# EAGLE design LiPo-Rechargable-ESP2866 (EAGLE 7.5.0)
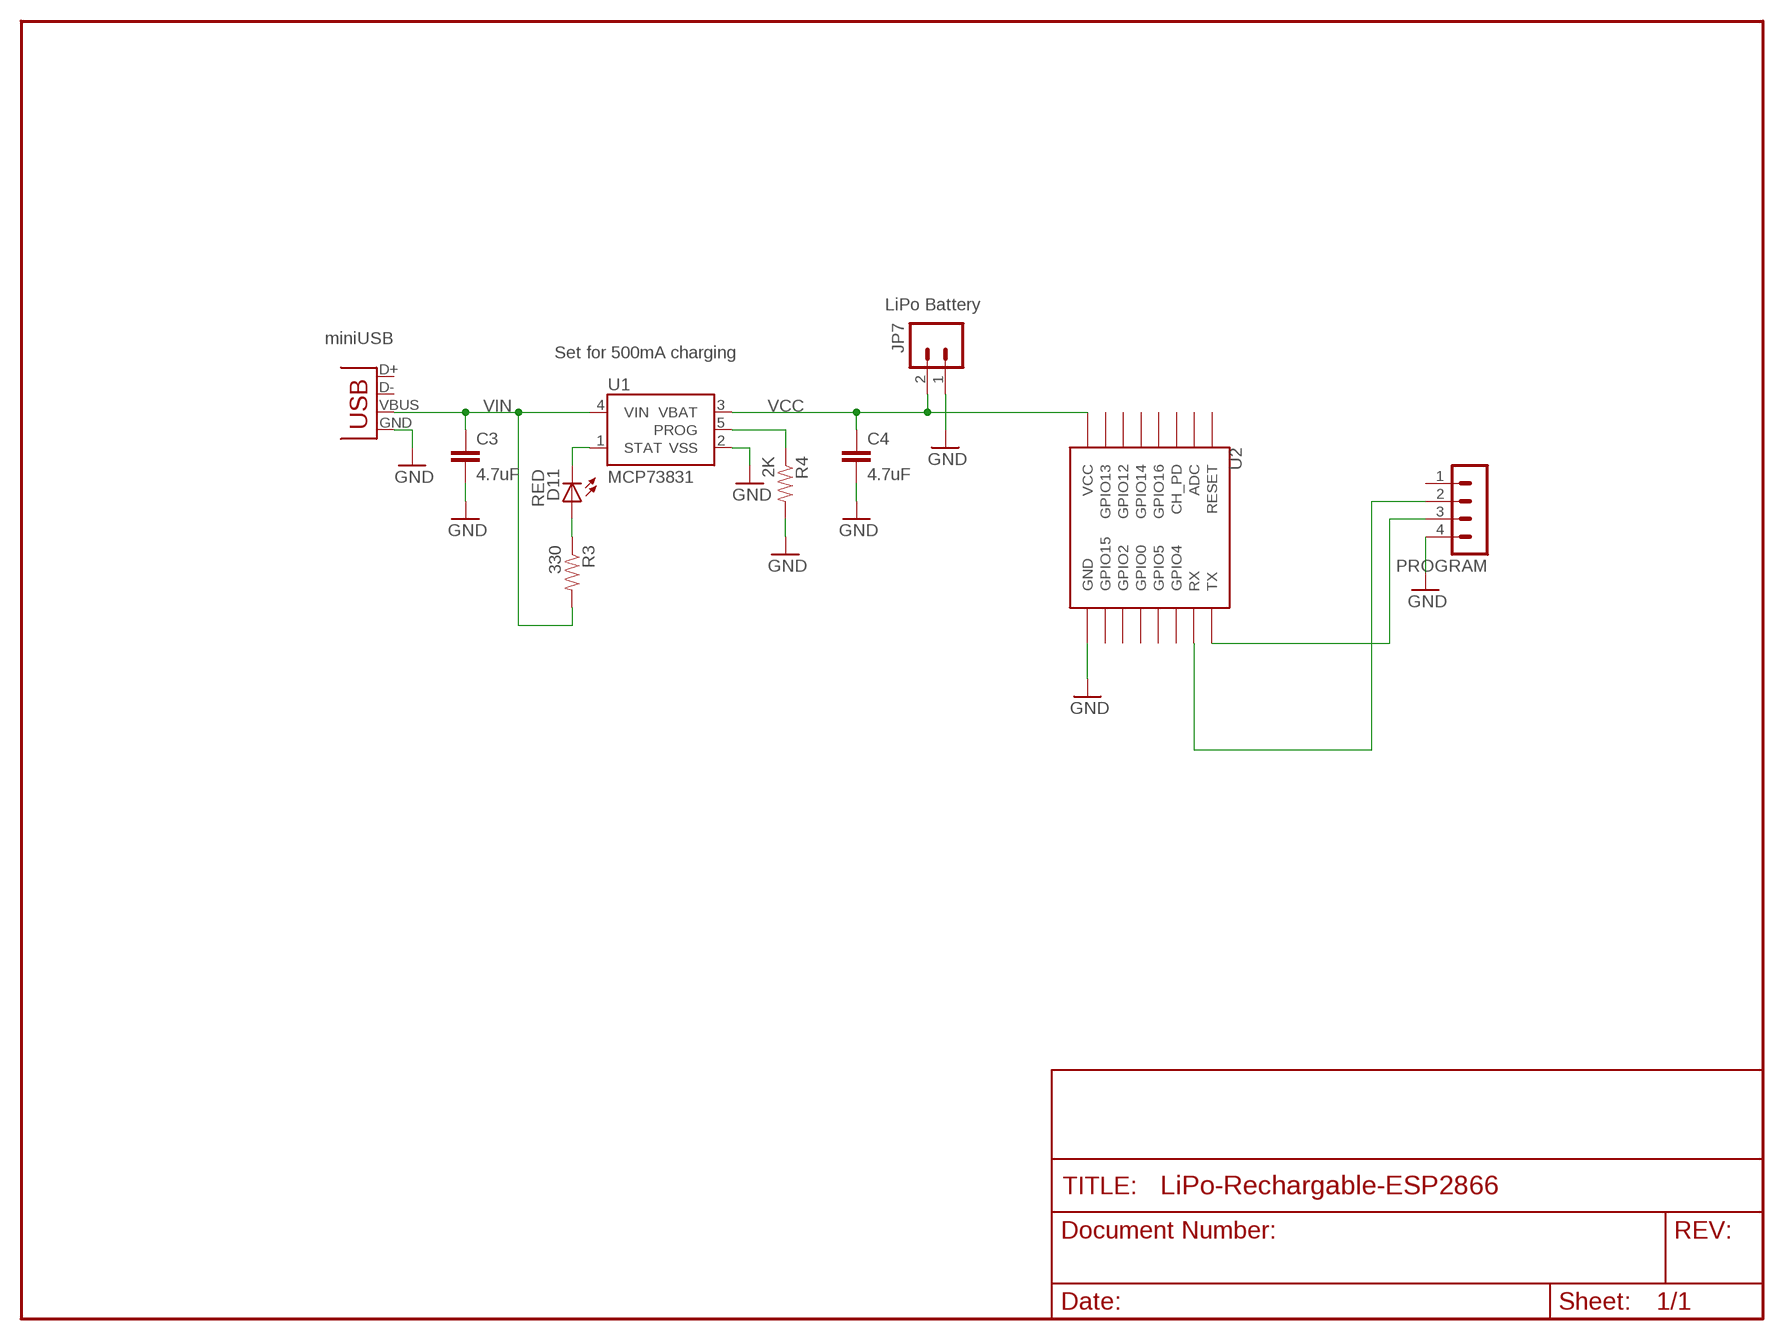
[diagram p0: schematic, sheet 1]

## Parts
C3  4.7uF  CAP0402-CAP  [0402-CAP]
C4  4.7uF  CAP0402-CAP  [0402-CAP]
D11  RED  LED0603  [LED-0603]
JP7  LiPo Battery  M02-JST-2MM-SMT  [JST-2-SMD]
PROGRAM  MA04-1  [MA04-1]
R3  330  RESISTOR0402-RES  [0402-RES]
R4  2K  RESISTOR0402-RES  [0402-RES]
U1  MCP73831  [SOT23-5]
U2  ESP12  [ESP12]
X1  Micro USB  USBSMD  [USB-MINIB]

## Nets
GND: C3.2 C4.2 JP7.1 PROGRAM.4 R4.2 U1.2(VSS) U2.GND X1.GND
N$1: PROGRAM.2 U2.RX
N$2: PROGRAM.3 U2.TX
N$3: D11.A R3.1
PROG: R4.1 U1.5(PROG)
STAT: D11.C U1.1(STAT)
VCC: C4.1 JP7.2 U1.3(VBAT) U2.VCC
VIN: C3.1 R3.2 U1.4(VIN) X1.VBUS
Unconnected: PROGRAM.1 U2.ADC U2.CH_PD U2.GPIO0 U2.GPIO2 U2.GPIO4 U2.GPIO5 U2.GPIO12 U2.GPIO13 U2.GPIO14 U2.GPIO15 U2.GPIO16 U2.RESET X1.D+ X1.D-

## Notes on the sheet
- miniUSB
- Set for 500mA charging

## Library data of the parts
C3 C4 = SparkFun:CAP: Capacitor Standard 0603 ceramic capacitor, and 0.1" leaded capacitor.
D11 = SparkFun:LED: LEDs Standard schematic elements and footprints for 5mm, 3mm, 1206, and 0603 sized LEDs. 5mm - Spark Fun Electronics SKU : COM-00529 (and others)
JP7 = SparkFun:M02: Header 2 Standard 2-pin 0.1" header. Use with straight break away headers (SKU : PRT-00116), right angle break away headers (PRT-00553), swiss pins (PRT-00743), machine pins (PRT-00117), and female headers (PRT-00115). Molex polarized connector foot print use with SKU : PRT-08233 with associated crimp pins and housings.
PROGRAM = con-lstb:MA04-1: PIN HEADER; OC_FARNELL: unknown; OC_NEWARK: unknown
R3 R4 = SparkFun:RESISTOR: Resistor Basic schematic elements and footprints for 0603, 1206, and PTH resistors.
U1 = SparkFun:MCP73831: Microchip's MCP73831 Miniature single cell, fully integrated Li-Ion, Li-polymer charge management controller http://ww1.microchip.com/downloads/en/DeviceDoc/21984a.pdf
U2 = esp8266modules:ESP12: ESP8266 Wifi module 12
X1 = SparkFun:USB: USB Connectors USB-B-PTH is fully proven SKU : PRT-00139 USB-miniB is fully proven SKU : PRT-00587 USB-A-PCB is untested. USB-A-H is throughly reviewed, but untested. Spark Fun Electronics SKU : PRT-00437 USB-B-SMT is throughly reviewed, but untested. Needs silkscreen touching up. USB-A-S has not been used/tested USB-MB-H has not been used/tested

## Board
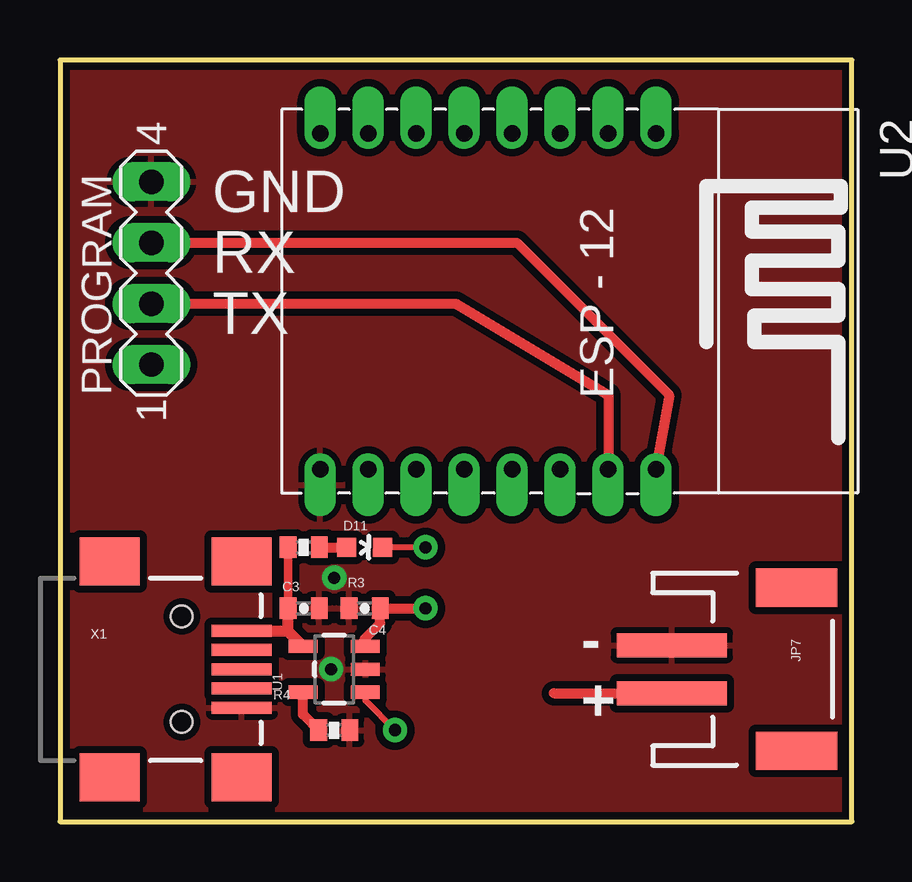
[diagram p1: board, top side]
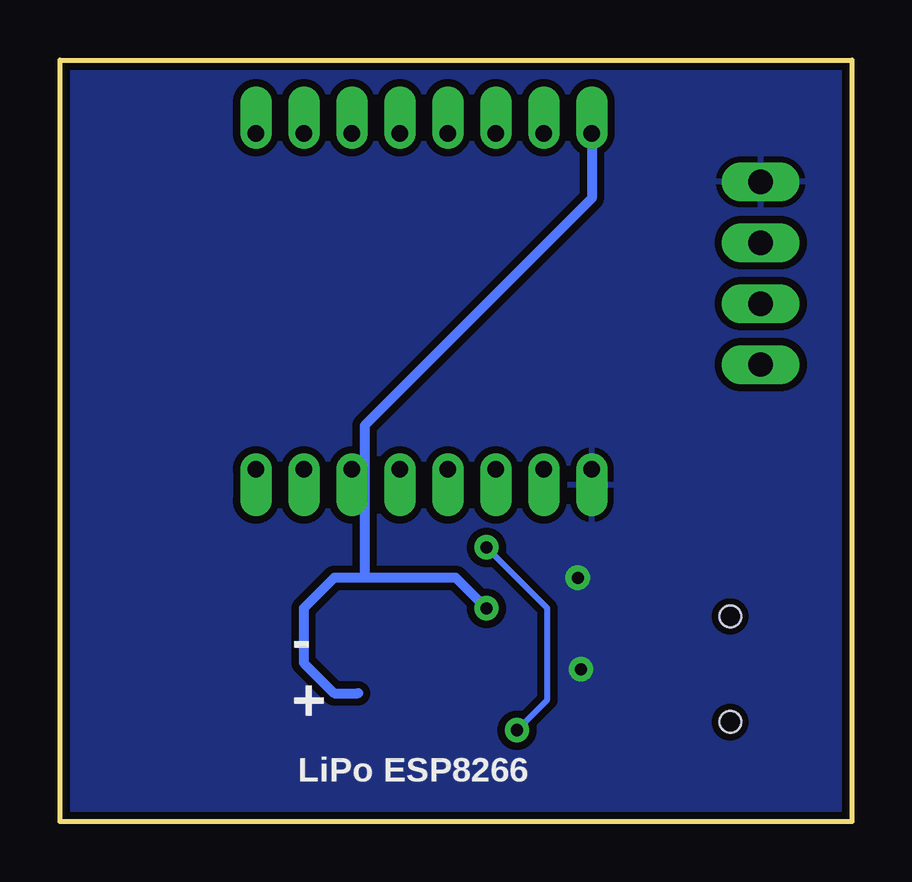
[diagram p2: board, bottom side, seen from below]

Size 33.02 x 31.75 mm. Coordinates in mm from the lower left corner, seen from the top.
Outline: 33.02,0 33.02,31.75 0,31.75 0,0 33.02,0
Copper layers (1*16): Top 0.035mm / dielectric 1.5mm / Bottom 0.035mm
Design rules "SparkFun": minimum track width 8mil, minimum drill 20mil, track to track 8mil, track to pad 8mil, pad to pad 8mil, via to via 8mil, smd to smd 8mil, copper to edge 8mil, drill to drill 8mil, minimum pad ring 12mil, minimum via ring 10mil, stop-mask expansion 4mil, vias tented up to drill 20mil, thermal gap 10mil

### Footprints (pad centres in the part's own frame; a part is rotated, then mirrored left to right if it is on the bottom)
0402-CAP = smd 0.7 x 0.9: 1 -0.65,0; 2 0.65,0
LED-0603 = smd 0.8 x 0.8: A 0,-0.75; C 0,0.75
JST-2-SMD = smd 1 x 4.6: 1 -1,-3.7; 2 1,-3.7 | smd 1.6 x 3.4: NC1 -3.4,1.5; NC2 3.4,1.5
MA04-1 = drill 1.016 long: 1 -3.81,0; 2 -1.27,0; 3 1.27,0; 4 3.81,0
0402-RES = smd 0.7 x 0.9: 1 -0.65,0; 2 0.65,0
SOT23-5 = smd 0.55 x 1.2: 1 -0.95,-1.3; 2 0,-1.3; 3 0.95,-1.3; 4 0.95,1.3; 5 -0.95,1.3
ESP12 = drill 0.7 offset: ADC -7.1,3.8; CH_PD -7.1,1.8; GND 6.9,-8.2; GPIO0 6.9,-2.2; GPIO2 6.9,-4.2; GPIO4 6.9,1.8; GPIO5 6.9,-0.2; GPIO12 -7.1,-4.2; GPIO13 -7.1,-6.2; GPIO14 -7.1,-2.2; GPIO15 6.9,-6.2; GPIO16 -7.1,-0.2; RESET -7.1,5.8; RX 6.9,3.8; TX 6.9,5.8; VCC -7.1,-8.2
USB-MINIB = smd 2.5 x 0.5: D+ 2.5,0; D- 2.5,0.8; GND 2.5,-1.6; ID 2.5,-0.8; VBUS 2.5,1.6 | smd 2.5 x 2: MTN1 -3,4.5; MTN2 2.5,4.5; MTN3 -3,-4.5; MTN4 2.5,-4.5 | hole 0.9: 0,2.2; 0,-2.2

### Placement (x,y rotation side)
C3  10.16,8.89 0 top
C4  12.7,8.89 180 top
D11  12.7,11.43 270 top
JP7  29.21,6.35 270 top
PROGRAM  3.81,22.86 90 top
R3  10.16,11.43 180 top
R4  11.43,3.81 0 top
U1  11.43,6.35 90 top
U2  19.05,21.59 270 top
X1  5.08,6.35 0 top

### Tracks (layer width: path | path; a pad name or v marks a point on that pad's centre or on a via)
GND  (via drill 0.51)
  other vias: 11.3,6.35 11.43,10.16
  pour Bottom (isolate 0.305): 0,0 0,31.75 33.02,31.75 33.02,0
  pour Top (isolate 0.305): 0,31.75 33.02,31.75 33.02,0 0,0
N$1
  Top 0.406: PROGRAM.2 16.51,21.59 22.86,17.78 U2.RX
N$2
  Top 0.406: PROGRAM.3 19.05,24.13 25.4,17.78 U2.TX
N$3
  Top 0.406: R3.1 D11.A
PROG
  Top 0.406: U1.5 10.13,4.46 R4.1
STAT  (via drill 0.51)
  Top 0.254: v15.24,11.43 D11.C | U1.1 12.73,5.05 v13.97,3.81
  Bottom 0.254: v13.97,3.81 12.7,5.08 12.7,8.89 v15.24,11.43
VCC  (via drill 0.51)  (1 unrouted)
  Top 0.406: v15.24,8.89 C4.1 13.35,8.27 12.7,7.62 12.7,7.33 U1.3 | 20.59,5.35 JP7.2
  Bottom 0.406: v15.24,8.89 16.51,10.16 20.32,10.16 | 20.32,10.16 21.59,10.16 22.86,8.89 22.86,6.62 21.59,5.35 20.59,5.35 | U2.VCC 10.85,25.98 20.32,16.51 20.32,10.16
VIN
  Top 0.356: C3.1 R3.2
  Top 0.457: 9.51,7.92 C3.1 | 9.51,7.92 U1.4 | X1.VBUS 9.48,7.95 9.51,7.92

### Text on the board
tPlace: - | +
bPlace: - | + | LiPo ESP8266
tNames: GND | RX | TX